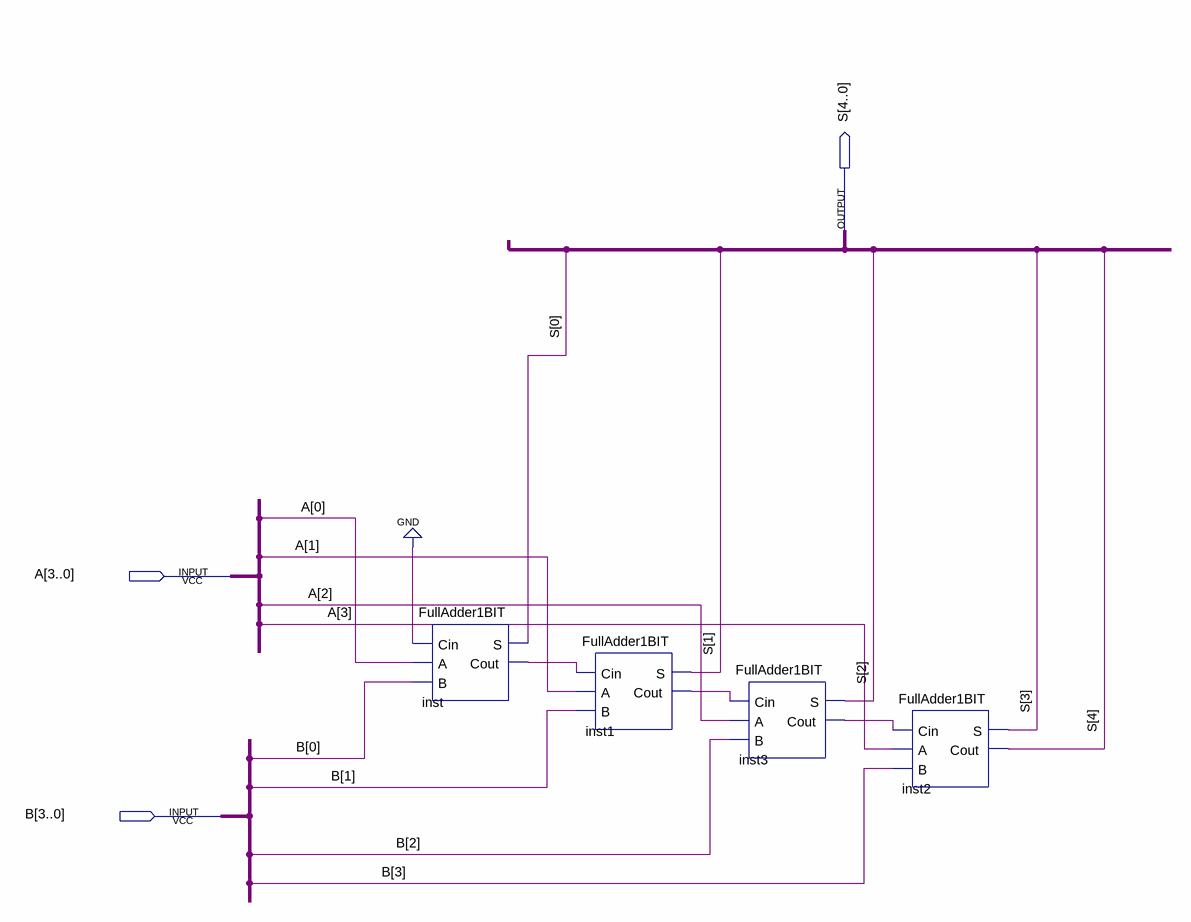
[diagram p0: schematic sheet]
// Quartus schematic FullAdder.bdf as structural Verilog: 4 symbols, 3 pins
module FullAdder (
  input  [3:0] A,
  input  [3:0] B,
  output [4:0] S
);

  wire inst1_cout, inst3_cout, inst_cout;

  FullAdder1BIT inst (.Cin(1'b0), .A(A[0]), .B(B[0]), .S(S[0]), .Cout(inst_cout));
  FullAdder1BIT inst1 (.Cin(inst_cout), .A(A[1]), .B(B[1]), .S(S[1]), .Cout(inst1_cout));
  FullAdder1BIT inst3 (.Cin(inst1_cout), .A(A[2]), .B(B[2]), .S(S[2]), .Cout(inst3_cout));
  FullAdder1BIT inst2 (.Cin(inst3_cout), .A(A[3]), .B(B[3]), .S(S[3]), .Cout(S[4]));
endmodule
